# EAGLE design Close_eMuff (EAGLE 9.6.0)
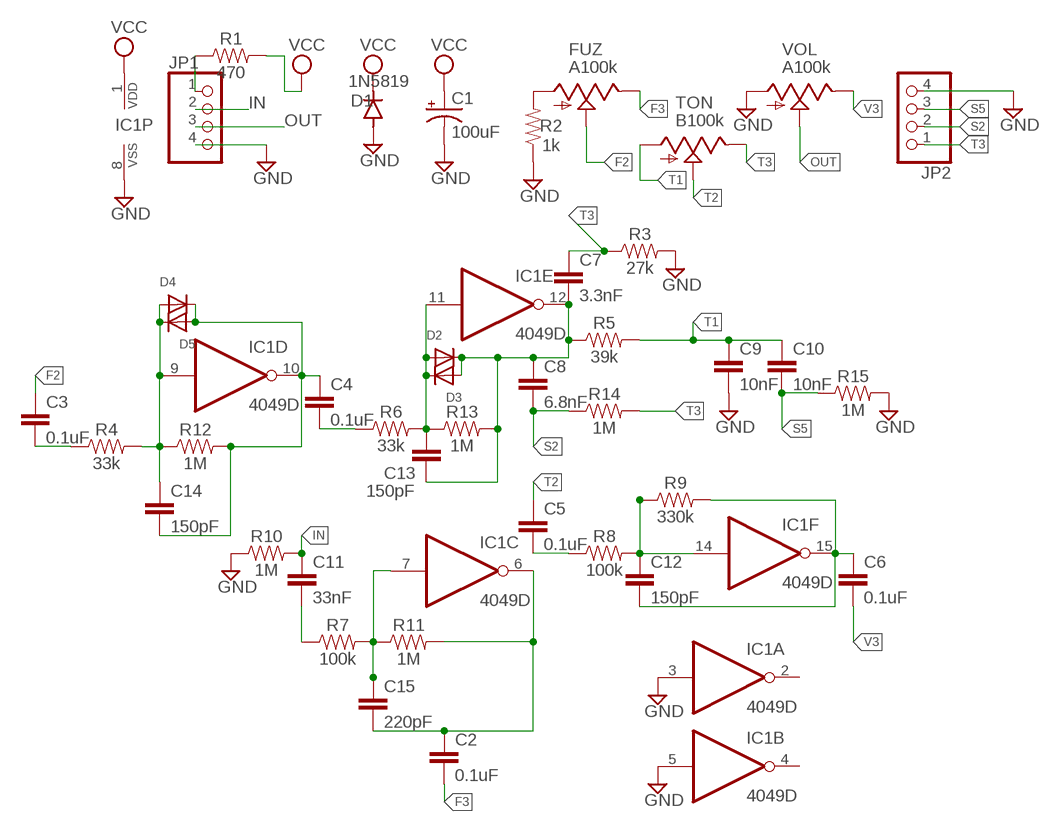
[diagram p0: schematic, sheet 1]

## Parts
C1  100uF  CAP_SMD+THRUPAN_B  [PAN_B_SMD+THRU]
C2  0.1uF  0.1UF-0603-25V-(+80/-20%)  [0603]
C3  0.1uF  0.1UF-0603-25V-(+80/-20%)  [0603]
C4  0.1uF  0.1UF-0603-25V-(+80/-20%)  [0603]
C5  0.1uF  0.1UF-0603-25V-(+80/-20%)  [0603]
C6  0.1uF  0.1UF-0603-25V-(+80/-20%)  [0603]
C7  3.3nF  3.3NF-0603-100V-10%  [0603]
C8  6.8nF  3.3NF-0603-100V-10%  [0603]
C9  10nF  10NF-0603-50V-10%  [0603]
C10  10nF  10NF-0603-50V-10%  [0603]
C11  33nF  33PF-0603-50V-5%  [0603]
C12  150pF  180PF-0603-50V-5%  [0603]
C13  150pF  180PF-0603-50V-5%  [0603]
C14  150pF  180PF-0603-50V-5%  [0603]
C15  220pF  270PF-0603-50V-5%  [0603]
D1  1N5819  DIODE-SOD123  [SOD123]
D2  DIODESOD-123  [SOD-123]
D3  DIODESOD-123  [SOD-123]
D4  DIODESOD-123  [SOD-123]
D5  DIODESOD-123  [SOD-123]
FUZ  A100k  9MM_SNAP-IN_POT_  [9MM_SNAP-IN_POT]
IC1  4049D  [SO16]
JP1  PINHD-1X4  [1X04]
JP2  PINHD-1X4  [1X04]
R1  470  470OHM-0603-1/10W-1%  [0603]
R2  1k  1KOHM-0603-1/10W-1%  [0603]
R3  27k  27OHM-0603-1/10W-1%  [0603]
R4  33k  33KOHM-0603-1/10W-1%  [0603]
R5  39k  39KOHM-0603-1/10W-1%  [0603]
R6  33k  33KOHM-0603-1/10W-1%  [0603]
R7  100k  100KOHM-0603-1/10W-1%  [0603]
R8  100k  100KOHM-0603-1/10W-1%  [0603]
R9  330k  330KOHM-0603-1/10W-1%  [0603]
R10  1M  1MOHM-0603-1/4W-5%  [0603]
R11  1M  1MOHM-0603-1/4W-5%  [0603]
R12  1M  1MOHM-0603-1/4W-5%  [0603]
R13  1M  1MOHM-0603-1/4W-5%  [0603]
R14  1M  1MOHM-0603-1/4W-5%  [0603]
R15  1M  1MOHM-0603-1/4W-5%  [0603]
TON  B100k  9MM_SNAP-IN_POT_  [9MM_SNAP-IN_POT]
VOL  A100k  9MM_SNAP-IN_POT_  [9MM_SNAP-IN_POT]

## Nets
F2: C3.1 FUZ.2(S)
F3: C2.2 FUZ.3(E)
GND: C1.- C1.--(-) C9.2 D1.A IC1.3(A:I) IC1.5(B:I) IC1.8(P:VSS) JP1.4 JP2.4 R2.1 R3.2 R10.1 R15.2 VOL.1(A)
IN: C11.1 JP1.2 R10.2
N$1: C11.2 R7.1
N$2: C15.1 IC1.7(C:I) R7.2 R11.1
N$3: FUZ.1(A) R2.2
N$4: C2.1 C15.2 IC1.6(C:O) R11.2
N$5: C3.2 R4.1
N$6: C14.1 D4.A D5.C IC1.9(D:I) R4.2 R12.1
N$7: C4.2 R6.1
N$8: C4.1 C14.2 D4.C D5.A IC1.10(D:O) R12.2
N$9: C13.1 D2.A D3.C IC1.11(E:I) R6.2 R13.1
N$10: JP1.1 R1.1
N$12: C5.2 R8.1
N$13: C7.2 C8.1 C13.2 D2.C D3.A IC1.12(E:O) R5.1 R13.2
N$14: C12.1 IC1.14(F:I) R8.2 R9.1
N$15: C6.1 C12.2 IC1.15(F:O) R9.2
OUT: JP1.3 VOL.2(S)
S2: C8.2 JP2.2 R14.1
S5: C10.2 JP2.3 R15.1
T1: C9.1 C10.1 R5.2 TON.1(A)
T2: C5.1 TON.2(S)
T3: C7.1 JP2.1 R3.1 R14.2 TON.3(E)
V3: C6.2 VOL.3(E)
VCC: C1.+ C1.++(+) D1.C IC1.1(P:VDD) R1.2
Unconnected: IC1.2(A:O) IC1.4(B:O)

## Library data of the parts
C1 = MusicThingModular:CAP_SMD+THRU
C2-C6 = SparkFun-Capacitors:0.1UF: 0.1µF ceramic capacitors A capacitor is a passive two-terminal electrical component used to store electrical energy temporarily in an electric field.; PROD_ID: CAP-00810
C7 = SparkFun-Capacitors:3.3NF: 3.3nF ceramic capacitors A capacitor is a passive two-terminal electrical component used to store electrical energy temporarily in an electric field.; PROD_ID: CAP-09633
C8 = SparkFun-Capacitors:3.3NF: 3.3nF ceramic capacitors A capacitor is a passive two-terminal electrical component used to store electrical energy temporarily in an electric field.; PROD_ID: CAP-09633; VALUE: 3.3nF
C9 C10 = SparkFun-Capacitors:10NF: 0.01uF/10nF/10,000pF ceramic capacitors A capacitor is a passive two-terminal electrical component used to store electrical energy temporarily in an electric field. CAP-09321; PROD_ID: CAP-00867
C11 = SparkFun-Capacitors:33PF: 33pF ceramic capacitors A capacitor is a passive two-terminal electrical component used to store electrical energy temporarily in an electric field.; PROD_ID: CAP-10142; VALUE: 33pF
C12-C14 = SparkFun-Capacitors:180PF: 180pF/0.18nF ceramic capacitors A capacitor is a passive two-terminal electrical component used to store electrical energy temporarily in an electric field.; PROD_ID: CAP-11661; VALUE: 180pF
C15 = SparkFun-Capacitors:270PF: 270pF/0.27nF ceramic capacitors A capacitor is a passive two-terminal electrical component used to store electrical energy temporarily in an electric field.; PROD_ID: CAP-13339; VALUE: 270PF
D1 = diode:DIODE-: DIODE
D2-D5 = adafruit:DIODE: Diode SMADIODE - SMA Surface Mount Package 20V 1A Schottky Diode Digikey: 641-1014-6-ND DO-1N4148 - Through Hole Small Current Diode SOD-123 20V 1 A (.5mV Vf) Schottky Diode - Digikey: MBRX120TPMSCT-ND SOD-323 10V 570mA (.38mV Vf, 3ns) Schottky Diode - Digikey: ZLLS410CT-ND SOD-523 30V 30mA Schottky Diode (RB751S-40TE61) - Digikey: RB751S-40TE61CT-ND SOT23-R/W - SOT23 Package (R = Solder Paste/Reflow Ovens, W = Hand-Soldering) BAT54Film 40V 300mA - Digikey: 497-7162-1-ND
FUZ TON VOL = MusicThingModular:9MM_SNAP-IN_POT: 9mm vertical snap-in pot, Alpha / Panasonic style
IC1 = 40xx:4049: Hex inverting BUFFER
JP1 = Connector:PINHD-1X4: PIN HEADER; CATEGORY: CONNECTOR; SUB-CATEGORY: PIN-HEADER
JP2 = pinhead:PINHD-1X4: PIN HEADER
R1 = SparkFun-Resistors:470OHM: 470Ω resistor A resistor is a passive two-terminal electrical component that implements electrical resistance as a circuit element. Resistors act to reduce current flow, and, at the same time, act to lower voltage levels within circuits. - Wikipedia; PROD_ID: RES-07869
R2 = SparkFun-Resistors:1KOHM: 1kΩ resistor A resistor is a passive two-terminal electrical component that implements electrical resistance as a circuit element. Resistors act to reduce current flow, and, at the same time, act to lower voltage levels within circuits. - Wikipedia; PROD_ID: RES-07856
R3 = SparkFun-Resistors:27OHM: 27Ω resistor A resistor is a passive two-terminal electrical component that implements electrical resistance as a circuit element. Resistors act to reduce current flow, and, at the same time, act to lower voltage levels within circuits. - Wikipedia; PROD_ID: RES-09334; VALUE: 27
R4 R6 = SparkFun-Resistors:33KOHM: 33kΩ resistor A resistor is a passive two-terminal electrical component that implements electrical resistance as a circuit element. Resistors act to reduce current flow, and, at the same time, act to lower voltage levels within circuits. - Wikipedia; PROD_ID: RES-08416
R5 = SparkFun-Resistors:39KOHM: 39kΩ resistor A resistor is a passive two-terminal electrical component that implements electrical resistance as a circuit element. Resistors act to reduce current flow, and, at the same time, act to lower voltage levels within circuits. - Wikipedia; PROD_ID: RES-12377
R7 R8 = SparkFun-Resistors:100KOHM: 100kΩ resistor A resistor is a passive two-terminal electrical component that implements electrical resistance as a circuit element. Resistors act to reduce current flow, and, at the same time, act to lower voltage levels within circuits. - Wikipedia; PROD_ID: RES-07828
R9 = SparkFun-Resistors:330KOHM: 330kΩ resistor A resistor is a passive two-terminal electrical component that implements electrical resistance as a circuit element. Resistors act to reduce current flow, and, at the same time, act to lower voltage levels within circuits. - Wikipedia; PROD_ID: RES-08968
R10-R15 = SparkFun-Resistors:1MOHM: 1MΩ resistor A resistor is a passive two-terminal electrical component that implements electrical resistance as a circuit element. Resistors act to reduce current flow, and, at the same time, act to lower voltage levels within circuits. - Wikipedia; PROD_ID: RES-07868

## Board
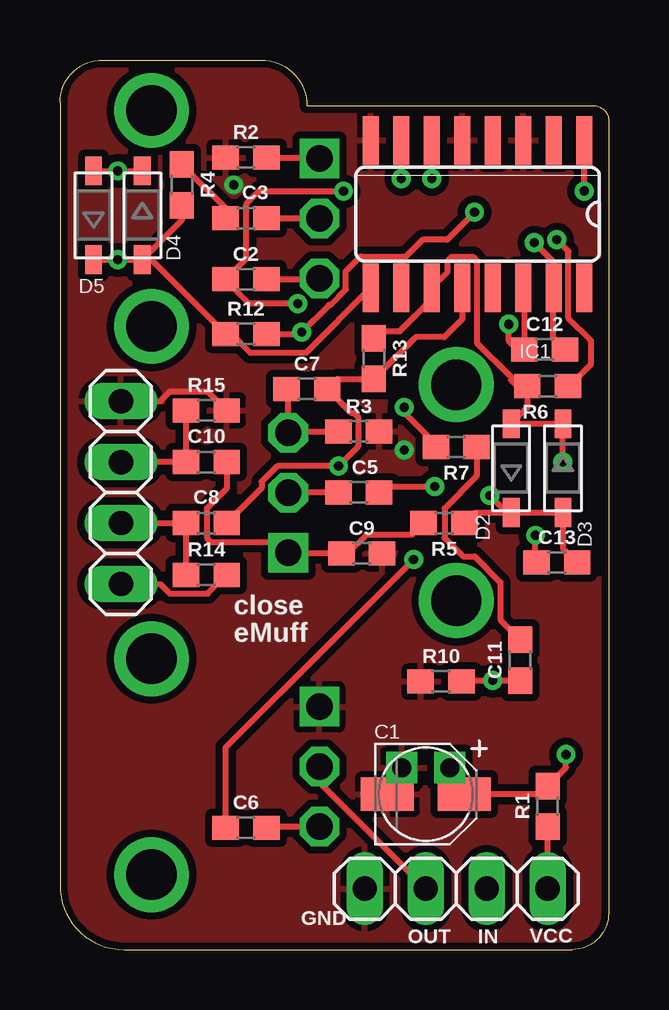
[diagram p1: board, top side]
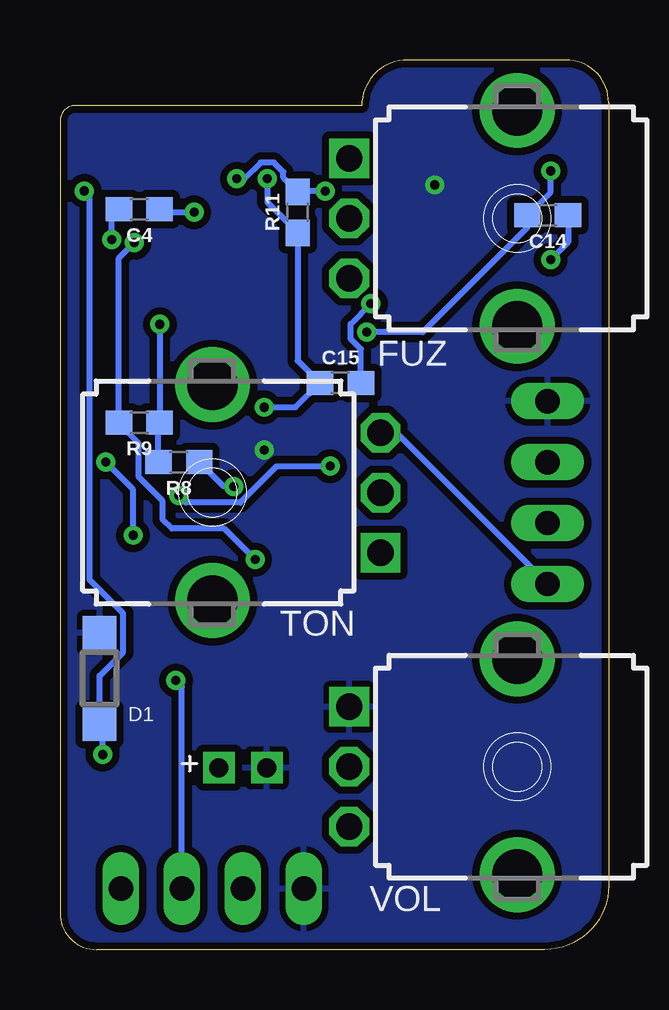
[diagram p2: board, bottom side, seen from below]

Size 22.86 x 37.08 mm. Coordinates in mm from the lower left corner, seen from the top.
Outline: 2.79,0 21.34,0 arc90 22.86,1.52 22.86,34.54 arc90 22.23,35.18 10.29,35.18 arc90 8.38,37.08 1.78,37.08 arc90 0,35.31 0,2.67 arc90 2.67,0 2.79,0
Copper layers (1*16): Top 0.035mm / dielectric 1.5mm / Bottom 0.035mm
Design rules "default *": minimum track width 6mil, minimum drill 0.35mm, track to track 6mil, track to pad 6mil, pad to pad 6mil, via to via 6mil, smd to smd 6mil, copper to edge 10mil, drill to drill 6mil, minimum pad ring 10mil, minimum via ring 8mil, stop-mask expansion 4mil, vias tented up to drill 0mil, thermal gap 10mil

### Footprints (pad centres in the part's own frame; a part is rotated, then mirrored left to right if it is on the bottom)
PAN_B_SMD+THRU = smd 2.2 x 1.4: + 1.6,0; - -1.6,0 | drill 0.8 pad 0.9 square: ++ 1,1.1; -- -1,1.1
0603 = smd 1.1 x 1: 1 -0.85,0; 2 0.85,0
SOD123 = smd 1.4 x 1.4: A 1.9,0; C -1.9,0
SOD-123 = smd 1.2 x 0.7: A 1.85,0; C -1.85,0
9MM_SNAP-IN_POT = drill 1.1 square: 1 -2.5,-7 | drill 1.1 octagon: 2 0,-7; 3 2.5,-7 | drill 2.1 pad 2.794: CHASSIS1 -4.5,0; CHASSIS2 4.5,0
SO16 = smd 0.66 x 2.032: 1 -4.445,-3.073; 2 -3.175,-3.073; 3 -1.905,-3.073; 4 -0.635,-3.073; 5 0.635,-3.073; 6 1.905,-3.073; 7 3.175,-3.073; 8 4.445,-3.073; 9 4.445,3.073; 10 3.175,3.073; 11 1.905,3.073; 12 0.635,3.073; 13 -0.635,3.073; 14 -1.905,3.073; 15 -3.175,3.073; 16 -4.445,3.073
1X04 = drill 1.016 long: 1 -3.81,0; 2 -1.27,0; 3 1.27,0; 4 3.81,0

### Placement (x,y rotation side)
C1  15.24,6.48 0 top
C2  7.75,27.94 0 top
C3  7.75,30.48 180 top
C4  19.56,30.86 180 bottom
C5  12.45,19.05 0 top
C6  7.75,5.08 0 top
C7  10.29,23.37 0 top
C8  6.1,17.78 180 top
C9  12.57,16.51 0 top
C10  6.1,20.32 180 top
C11  19.18,12.06 90 top
C12  20.19,25.02 0 top
C13  20.7,16.13 0 top
C14  2.54,30.61 180 bottom
C15  11.18,23.62 0 bottom
D1  21.21,11.3 90 bottom
D2  18.8,20.07 90 top
D3  20.95,20.07 270 top
D4  3.43,30.61 270 top
D5  1.4,30.61 90 top
FUZ  3.81,30.48 270 bottom
IC1  17.4,30.66 180 top
JP1  16.51,2.54 180 top
JP2  2.54,19.05 90 top
R1  20.32,5.97 90 top
R2  7.75,33.02 0 top
R3  12.45,21.59 0 top
R4  5.08,31.88 270 top
R5  16,17.78 180 top
R6  20.32,23.5 180 top
R7  16.51,20.95 180 top
R8  17.91,20.32 180 bottom
R9  19.56,21.97 180 bottom
R10  15.88,11.18 0 top
R11  12.95,30.73 90 bottom
R12  7.75,25.65 0 top
R13  13.08,24.64 270 top
R14  6.1,15.62 0 top
R15  6.1,22.48 0 top
TON  16.51,19.05 90 bottom
VOL  3.81,7.62 270 bottom

### Tracks (layer width: path | path; a pad name or v marks a point on that pad's centre or on a via)
F2
  Top 0.254: C3.1 FUZ.2
F3
  Top 0.254: C2.2 10.77,27.94 FUZ.3
GND  (via drill 0.38)
  Top 0.254: JP2.4 4.18,22.86 4.58,23.26 6.17,23.26 R15.2
  other vias: 14.35,20.83 7.24,31.88
  pour Top (isolate 0.305): -0.38,37.85 -0.38,-0.64 0,-1.02 22.86,-1.02 24.51,0.64 24.51,37.47 23.62,38.35
  pour Bottom (isolate 0.305): -0.38,-0.64 0.25,-1.27 22.86,-1.27 24.64,0.51 24.64,36.58 22.99,38.23 -0.38,38.1
IN  (via drill 0.38)
  Top 0.254: R10.2 16.76,11.21 v18.03,11.21 C11.1
  Bottom 0.254: JP1.2 17.78,10.96 v18.03,11.21
N$1
  Top 0.254: R7.1 17.36,19.73 16.02,18.4 16.02,17.16 16.8,16.39 17.27,16.39 18.35,15.31 18.35,13.74 C11.2
N$2  (via drill 0.38)
  Top 0.254: IC1.7 v14.22,32.13 | R7.2 15.66,21.08 14.35,22.39 v14.35,22.61
  Bottom 0.254: v14.35,22.61 13.04,22.61 C15.1 12.95,24.55 R11.1 14.22,31.15 v14.22,32.13
N$3
  Top 0.254: FUZ.1 8.64,32.98 R2.2
N$4  (via drill 0.38)
  Top 0.254: IC1.6 v15.49,32.13 | v11.81,31.61 8.28,31.61 7.77,31.1 7.77,28.81 C2.1 6.88,27.92 7.87,26.92 v9.91,26.92
  Bottom 0.254: v15.49,32.13 15.18,32.13 14.5,32.8 13.95,32.8 13.55,32.41 13.55,32.18 R11.2 12.93,31.61 v11.81,31.61 | C15.2 10.33,25.03 10.75,25.46 10.75,26.08 v9.91,26.92
N$5
  Top 0.254: R4.1 6.9,30.91 C3.2
N$6  (via drill 0.38)
  Top 0.254: D5.C v2.41,28.76 D4.A | D4.A 3.79,28.76 R12.1 7.15,25.65 7.93,24.88 10.24,24.88 IC1.9 | R4.2 5.08,30.41 D4.A
  Bottom 0.254: C14.1 1.69,29.48 v2.41,28.76
N$7  (via drill 0.38)
  Top 0.254: R6.1 21.22,23.5 22.13,24.4 22.13,25.38 21.18,26.32 21.18,29.11 v20.7,29.59
  Bottom 0.254: v20.7,29.59 20.7,30.57 C4.2
N$8  (via drill 0.38)
  Top 0.254: D5.A v2.41,32.46 D4.C | v17.27,30.73 16.13,29.59 15.11,29.59 14.41,28.89 | 14.41,28.89 14.22,28.7 IC1.10 | R12.2 9.99,25.65 v10.08,25.74 11.22,26.88 11.27,26.88 11.91,27.52 11.91,28.29 12.52,28.89 14.41,28.89
  Bottom 0.254: v2.41,32.46 2.41,31.58 C14.2 3.39,30.1 7.75,25.74 v10.08,25.74 | C4.1 18.58,30.73 v17.27,30.73
N$9  (via drill 0.38)
  Top 0.254: R13.1 13.37,25.78 14.16,25.78 15.49,27.11 IC1.11 16.15,28.25 16.15,28.72 16.32,28.88 17.21,28.88 17.37,28.72 17.37,25.29 18.8,23.87 18.8,23.75 19.05,23.5 R6.2 19.47,22.59 D2.A D3.C v20.95,20.32 | C13.1 19.81,16.17 v19.81,17.27
  Bottom 0.254: v19.81,17.27 19.81,19.18 v20.95,20.32
N$10
  Top 0.254: JP1.1 R1.1
N$12  (via drill 0.38)
  Top 0.254: C5.2 13.55,19.3 v15.62,19.3
  Bottom 0.254: v15.62,19.3 16.04,19.3 R8.1
N$13  (via drill 0.38)
  Top 0.254: IC1.12 16.76,26.29 16,25.53 14.82,25.53 R13.2 11.56,23.79 C7.2 12.14,22.37 12.26,22.37 12.43,22.21 12.43,20.97 v11.61,20.15 9.05,20.15 8.41,19.51 8.41,19.24 C8.1 | D3.A 20.95,18.03 | 20.95,18.03 20.95,16.73 C13.2 | D2.C 17.29,18.22 R5.1 | D2.C 20.77,18.22 20.95,18.03 | v17.91,18.92 18.61,18.22 D2.C
  Bottom 0.254: v11.61,20.15 13.82,20.15 15.34,18.63 17.61,18.63 v17.91,18.92
N$14  (via drill 0.38)
  Top 0.254: IC1.14 19.34,27.55 C12.1 19.05,25.02 18.7,25.37 v18.7,26.07
  Bottom 0.254: v18.7,26.07 R9.1 18.76,21.92 R8.2
N$15  (via drill 0.38)
  Top 0.254: C12.2 20.54,25.53 20.54,27.55 IC1.15 20.57,28.65 v19.76,29.46 | C6.1 6.9,8.42 v14.73,16.26
  Bottom 0.254: v19.76,29.46 20.41,28.82 R9.2 20.41,21.93 19.59,21.11 19.59,19.7 18.58,18.7 18.58,17.94 18.19,17.54 16.02,17.54 v14.73,16.26
OUT
  Top 0.254: JP1.3 10.81,6.97 VOL.2
S2
  Top 0.254: JP2.2 C8.2 R14.1
S5
  Top 0.254: JP2.3 C10.2 R15.1
T1
  Top 0.254: 9.65,16.51 C9.1 11.98,16.51 12.76,17.29 14.66,17.29 R5.2 | 9.65,16.51 9.55,16.51 TON.1 | C10.1 6.95,19.23 6.12,18.4 6.12,17.16 6.28,17 9.16,17 9.65,16.51
T2
  Top 0.254: C5.1 TON.2
T3
  Top 0.254: C7.1 9.51,23.3 TON.3 9.55,21.59 R3.1 | JP2.1 4.18,15.24 4.58,14.84 6.17,14.84 R14.2
  Bottom 0.254: JP2.1 8.85,21.55 TON.3
V3
  Top 0.254: VOL.3 8.64,5.12 C6.2
VCC  (via drill 0.38)
  Top 0.254: v21.08,8.13 21.08,7.58 R1.2 19.98,6.48 C1.+ 16.24,7.08 C1.++ | v21.84,31.62 IC1.1
  Bottom 0.254: v21.08,8.13 21.08,9.28 D1.C 21.21,11.41 20.23,12.39 20.23,14.02 21.63,15.42 21.63,31.41 v21.84,31.62

### Text on the board
tPlace: close | eMuff | GND | OUT | IN | VCC